# EAGLE design Robot_Psoc_Caras_2_2 (EAGLE 7.5.0)
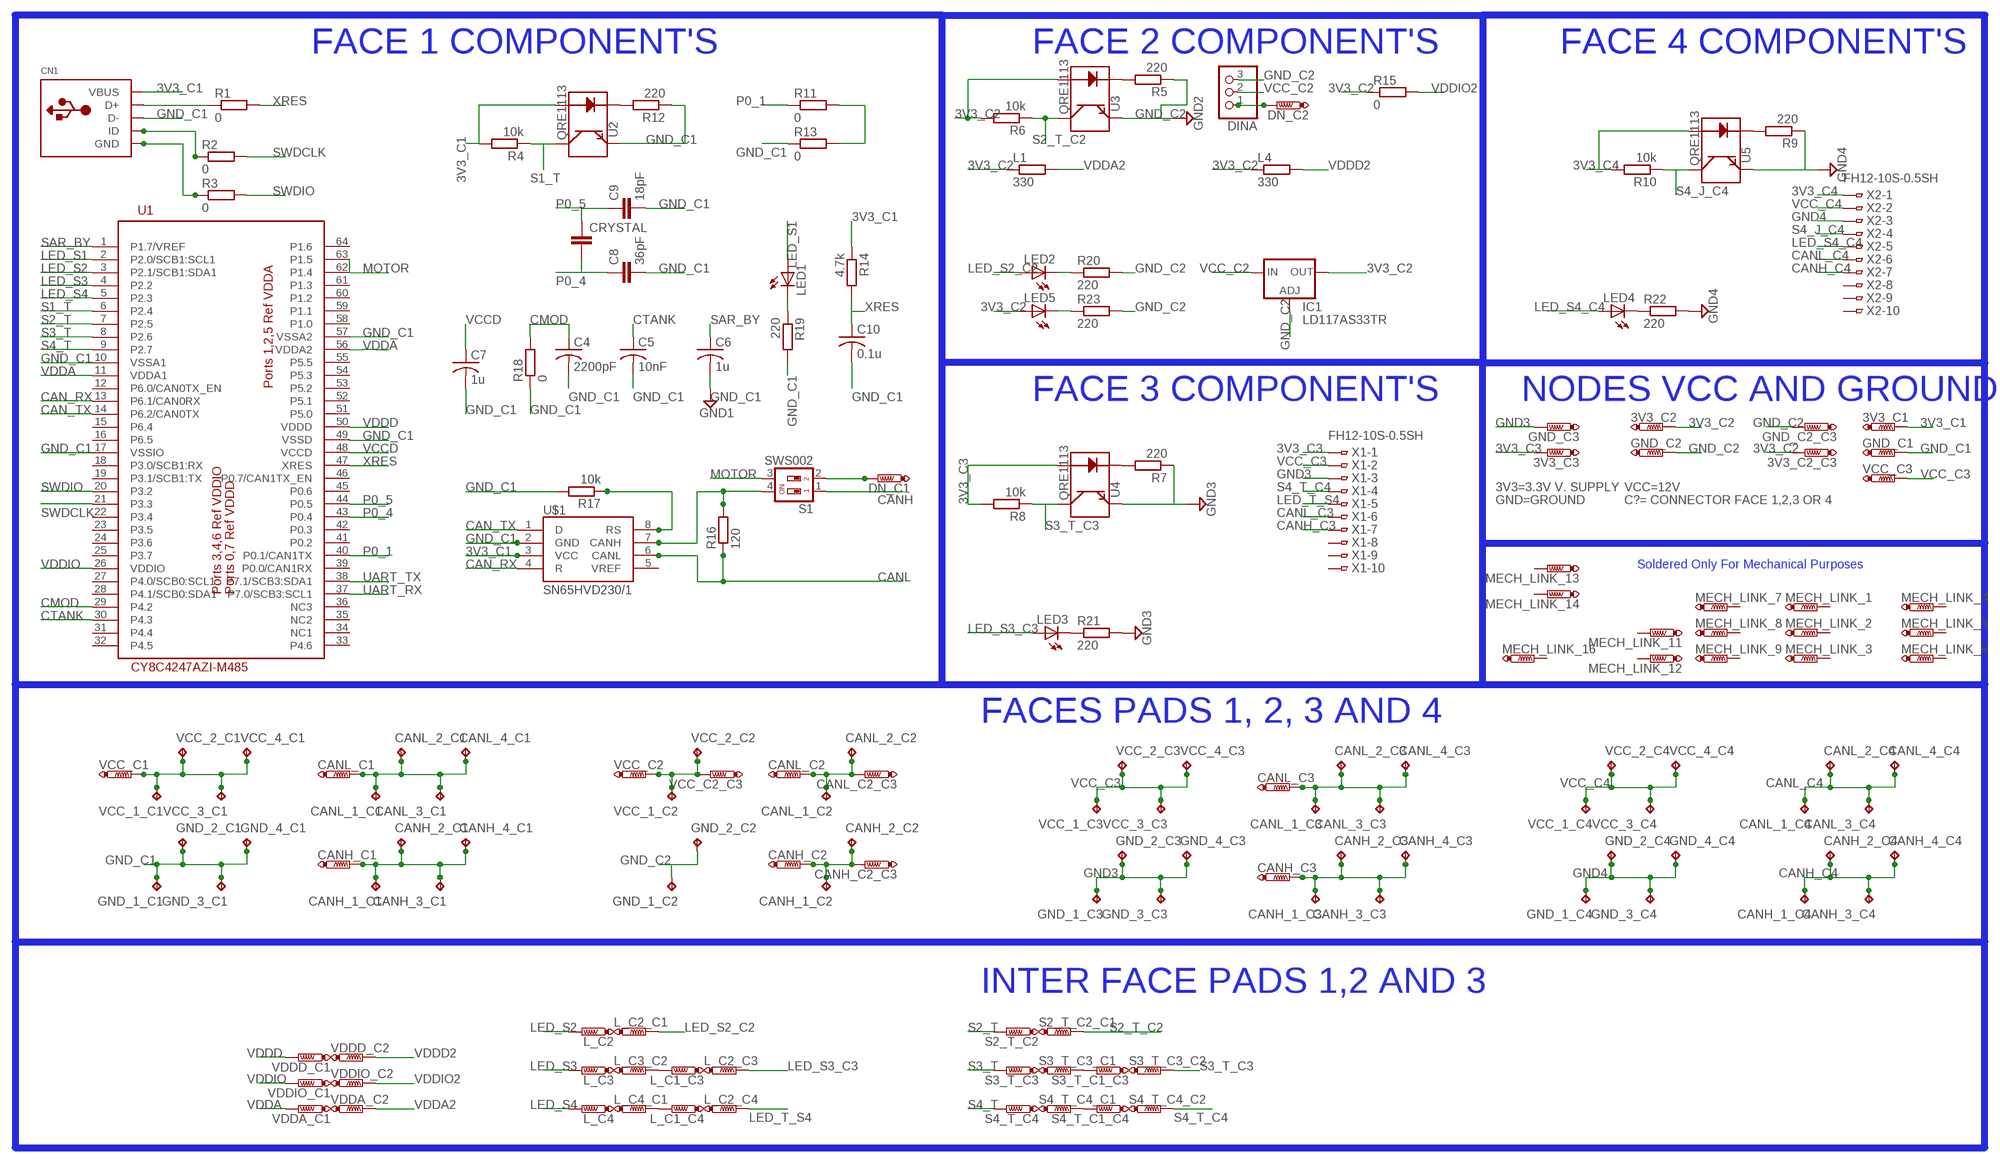
[diagram p0: schematic, sheet 1]

## Parts
3V3_C1  PTR1TP11R  [TP11R]
3V3_C2  PTR1TP11R  [TP11R]
3V3_C2_C3  PTR1TP11R  [TP11R]
3V3_C3  PTR1TP11R  [TP11R]
C4  2200pF  C-USC0805  [C0805]
C5  10nF  C-USC0805  [C0805]
C6  1u  C-USC0805  [C0805]
C7  1u  C-USC0805  [C0805]
C8  36pF  C-EUC0805  [C0805]
C9  18pF  C-EUC0805  [C0805]
C10  0.1u  C-USC0805  [C0805]
CANH_1_C1  TPB2,54  [B2,54]
CANH_1_C2  TPB2,54  [B2,54]
CANH_1_C3  TPB2,54  [B2,54]
CANH_1_C4  TPB2,54  [B2,54]
CANH_2_C1  TPB2,54  [B2,54]
CANH_2_C2  TPB2,54  [B2,54]
CANH_2_C3  TPB2,54  [B2,54]
CANH_2_C4  TPB2,54  [B2,54]
CANH_3_C1  TPB2,54  [B2,54]
CANH_3_C3  TPB2,54  [B2,54]
CANH_3_C4  TPB2,54  [B2,54]
CANH_4_C1  TPB2,54  [B2,54]
CANH_4_C3  TPB2,54  [B2,54]
CANH_4_C4  TPB2,54  [B2,54]
CANH_C1  PTR1TP11R  [TP11R]
CANH_C2  PTR1TP11R  [TP11R]
CANH_C2_C3  PTR1TP11R  [TP11R]
CANH_C3  PTR1TP11R  [TP11R]
CANL_1_C1  TPB2,54  [B2,54]
CANL_1_C2  TPB2,54  [B2,54]
CANL_1_C3  TPB2,54  [B2,54]
CANL_1_C4  TPB2,54  [B2,54]
CANL_2_C1  TPB2,54  [B2,54]
CANL_2_C2  TPB2,54  [B2,54]
CANL_2_C3  TPB2,54  [B2,54]
CANL_2_C4  TPB2,54  [B2,54]
CANL_3_C1  TPB2,54  [B2,54]
CANL_3_C3  TPB2,54  [B2,54]
CANL_3_C4  TPB2,54  [B2,54]
CANL_4_C1  TPB2,54  [B2,54]
CANL_4_C3  TPB2,54  [B2,54]
CANL_4_C4  TPB2,54  [B2,54]
CANL_C1  PTR1TP11R  [TP11R]
CANL_C2  PTR1TP11R  [TP11R]
CANL_C2_C3  PTR1TP11R  [TP11R]
CANL_C3  PTR1TP11R  [TP11R]
CN1  USBMINIB  [USB-MINIB]
CRYSTAL  C-EUC0603  [C0603]
DINA  PINHD-1X3  [1X03]
DN_C1  PTR1TP11R  [TP11R]
DN_C2  PTR1TP11R  [TP11R]
GND_1_C1  TPB2,54  [B2,54]
GND_1_C2  TPB2,54  [B2,54]
GND_1_C3  TPB2,54  [B2,54]
GND_1_C4  TPB2,54  [B2,54]
GND_2_C1  TPB2,54  [B2,54]
GND_2_C2  TPB2,54  [B2,54]
GND_2_C3  TPB2,54  [B2,54]
GND_2_C4  TPB2,54  [B2,54]
GND_3_C1  TPB2,54  [B2,54]
GND_3_C3  TPB2,54  [B2,54]
GND_3_C4  TPB2,54  [B2,54]
GND_4_C1  TPB2,54  [B2,54]
GND_4_C3  TPB2,54  [B2,54]
GND_4_C4  TPB2,54  [B2,54]
GND_C1  PTR1TP11R  [TP11R]
GND_C2  PTR1TP11R  [TP11R]
GND_C2_C3  PTR1TP11R  [TP11R]
GND_C3  PTR1TP11R  [TP11R]
IC1  LD117AS33TR  [SOT223]
L1  330  R-EU_R0805  [R0805]
L4  330  R-EU_R0805  [R0805]
L_C1_C3  PTR1TP11R  [TP11R]
L_C1_C4  PTR1TP11R  [TP11R]
L_C2  PTR1TP11R  [TP11R]
L_C2_C1  PTR1TP11R  [TP11R]
L_C2_C3  PTR1TP11R  [TP11R]
L_C2_C4  PTR1TP11R  [TP11R]
L_C3  PTR1TP11R  [TP11R]
L_C3_C2  PTR1TP11R  [TP11R]
L_C4  PTR1TP11R  [TP11R]
L_C4_C1  PTR1TP11R  [TP11R]
LED1  LEDCHIPLED_0805  [CHIPLED_0805]
LED2  LEDCHIPLED_0805  [CHIPLED_0805]
LED3  LEDCHIPLED_0805  [CHIPLED_0805]
LED4  LEDCHIPLED_0805  [CHIPLED_0805]
LED5  LEDCHIPLED_0805  [CHIPLED_0805]
MECH_LINK_1  PTR1TP11R  [TP11R]
MECH_LINK_2  PTR1TP11R  [TP11R]
MECH_LINK_3  PTR1TP11R  [TP11R]
MECH_LINK_4  PTR1TP11R  [TP11R]
MECH_LINK_5  PTR1TP11R  [TP11R]
MECH_LINK_6  PTR1TP11R  [TP11R]
MECH_LINK_7  PTR1TP11R  [TP11R]
MECH_LINK_8  PTR1TP11R  [TP11R]
MECH_LINK_9  PTR1TP11R  [TP11R]
MECH_LINK_11  PTR1TP11R  [TP11R]
MECH_LINK_12  PTR1TP11R  [TP11R]
MECH_LINK_13  PTR1TP11R  [TP11R]
MECH_LINK_14  PTR1TP11R  [TP11R]
MECH_LINK_16  PTR1TP11R  [TP11R]
R1  0  R-EU_R0805  [R0805]
R2  0  R-EU_R0805  [R0805]
R3  0  R-EU_R0805  [R0805]
R4  10k  R-EU_R0805  [R0805]
R5  220  R-EU_R0805  [R0805]
R6  10k  R-EU_R0805  [R0805]
R7  220  R-EU_R0805  [R0805]
R8  10k  R-EU_R0805  [R0805]
R9  220  R-EU_R0805  [R0805]
R10  10k  R-EU_R0805  [R0805]
R11  0  R-EU_R0805  [R0805]
R12  220  R-EU_R0805  [R0805]
R13  0  R-EU_R0805  [R0805]
R14  4.7k  R-EU_R0805  [R0805]
R15  0  R-EU_R0805  [R0805]
R16  120  R-EU_R0805  [R0805]
R17  10k  R-EU_R0805  [R0805]
R18  0  R-EU_R0805  [R0805]
R19  220  R-EU_R0805  [R0805]
R20  220  R-EU_R0805  [R0805]
R21  220  R-EU_R0805  [R0805]
R22  220  R-EU_R0805  [R0805]
R23  220  R-EU_R0805  [R0805]
S1  SWS002  [SMS-002]
S2_T_C2  PTR1TP11R  [TP11R]
S2_T_C2_C1  PTR1TP11R  [TP11R]
S3_T_C1_C3  PTR1TP11R  [TP11R]
S3_T_C3  PTR1TP11R  [TP11R]
S3_T_C3_C1  PTR1TP11R  [TP11R]
S3_T_C3_C2  PTR1TP11R  [TP11R]
S4_T_C1_C4  PTR1TP11R  [TP11R]
S4_T_C4  PTR1TP11R  [TP11R]
S4_T_C4_C1  PTR1TP11R  [TP11R]
S4_T_C4_C2  PTR1TP11R  [TP11R]
U1  CY8C4247AZI-M485  [TQFP64-10X10]
U2  QRE1113  [QRE1113]
U3  QRE1113  [QRE1113]
U4  QRE1113  [QRE1113]
U5  QRE1113  [QRE1113]
U$1  SN65HVD230/1  [SO8]
VCC_1_C1  TPB2,54  [B2,54]
VCC_1_C2  TPB2,54  [B2,54]
VCC_1_C3  TPB2,54  [B2,54]
VCC_1_C4  TPB2,54  [B2,54]
VCC_2_C1  TPB2,54  [B2,54]
VCC_2_C2  TPB2,54  [B2,54]
VCC_2_C3  TPB2,54  [B2,54]
VCC_2_C4  TPB2,54  [B2,54]
VCC_3_C1  TPB2,54  [B2,54]
VCC_3_C3  TPB2,54  [B2,54]
VCC_3_C4  TPB2,54  [B2,54]
VCC_4_C1  TPB2,54  [B2,54]
VCC_4_C3  TPB2,54  [B2,54]
VCC_4_C4  TPB2,54  [B2,54]
VCC_C1  PTR1TP11R  [TP11R]
VCC_C2  PTR1TP11R  [TP11R]
VCC_C2_C3  PTR1TP11R  [TP11R]
VCC_C3  PTR1TP11R  [TP11R]
VDDA_C1  PTR1TP11R  [TP11R]
VDDA_C2  PTR1TP11R  [TP11R]
VDDD_C1  PTR1TP11R  [TP11R]
VDDD_C2  PTR1TP11R  [TP11R]
VDDIO_C1  PTR1TP11R  [TP11R]
VDDIO_C2  PTR1TP11R  [TP11R]
X1  FH12-10S-0.5SH  [FH12-10S-0.5SH]
X2  FH12-10S-0.5SH  [FH12-10S-0.5SH]

## Nets
3V3_C1: 3V3_C1.TP CN1.VBUS R4.2 R14.1 U2.1(A) U$1.3(VCC)
3V3_C2: 3V3_C2.TP 3V3_C2_C3.TP IC1.4(OUT) L1.1 L4.1 LED5.A R6.2 R15.1 U3.1(A)
3V3_C3: 3V3_C3.TP R8.2 U4.1(A) X1.1
3V3_C4: R10.2 U5.1(A) X2.1
CAN_RX: U1.13(P6.1/CAN0RX) U$1.4(R)
CAN_TX: U1.14(P6.2/CAN0TX) U$1.1(D)
CANH: CANH_1_C1.TP CANH_2_C1.TP CANH_3_C1.TP CANH_4_C1.TP CANH_C1.TP S1.1
CANH_C3: CANH_1_C3.TP CANH_2_C3.TP CANH_3_C3.TP CANH_4_C3.TP CANH_C3.TP X1.7
CANH_C4: CANH_1_C4.TP CANH_2_C4.TP CANH_3_C4.TP CANH_4_C4.TP X2.7
CANL: CANL_1_C1.TP CANL_2_C1.TP CANL_3_C1.TP CANL_4_C1.TP CANL_C1.TP R16.1 U$1.6(CANL)
CANL_C3: CANL_1_C3.TP CANL_2_C3.TP CANL_3_C3.TP CANL_4_C3.TP CANL_C3.TP X1.6
CANL_C4: CANL_1_C4.TP CANL_2_C4.TP CANL_3_C4.TP CANL_4_C4.TP X2.6
CMOD: C4.1 R18.2 U1.29(P4.2)
CTANK: C5.1 U1.30(P4.3)
GND3: GND_1_C3.TP GND_2_C3.TP GND_3_C3.TP GND_4_C3.TP GND_C3.TP R7.1 R21.2 U4.4(E) X1.3
GND4: GND_1_C4.TP GND_2_C4.TP GND_3_C4.TP GND_4_C4.TP R9.1 R22.2 U5.4(E) X2.3
GND_C1: C4.2 C5.2 C6.2 C7.2 C8.2 C9.2 C10.2 CN1.D- GND_1_C1.TP GND_2_C1.TP GND_3_C1.TP GND_4_C1.TP GND_C1.TP R12.1 R13.1 R17.2 R18.1 R19.2 U1.10(VSSA1) U1.17(VSSIO) U1.49(VSSD) U1.57(VSSA2) U2.4(E) U$1.2(GND) ; supply symbol labelled GND1
GND_C2: DINA.3 GND_1_C2.TP GND_2_C2.TP GND_C2.TP GND_C2_C3.TP IC1.1(ADJ) R5.1 R20.2 R23.2 U3.4(E) ; supply symbol labelled GND2
LED_S1: LED1.A U1.2(P2.0/SCB1:SCL1)
LED_S2: L_C2.TP U1.3(P2.1/SCB1:SDA1)
LED_S2_C2: L_C2_C1.TP LED2.A
LED_S3: L_C3.TP U1.4(P2.2)
LED_S3_C3: L_C2_C3.TP LED3.A
LED_S4: L_C4.TP U1.5(P2.3)
LED_S4_C4: LED4.A X2.5
LED_T_S4: L_C2_C4.TP X1.5
MOTOR: S1.3 U1.62(P1.4) U1.63(P1.5)
N$1: CN1.D+ R1.1
N$2: CN1.ID R2.1
N$3: CN1.GND R3.1
N$4: R11.2 R13.2
N$5: R16.2 S1.4 U$1.7(CANH)
N$6: R5.2 U3.2(K)
N$7: CANH_1_C2.TP CANH_2_C2.TP CANH_C2.TP CANH_C2_C3.TP
N$8: R7.2 U4.2(K)
N$9: R17.1 U$1.8(RS)
N$10: R9.2 U5.2(K)
N$13: DN_C1.TP S1.2
N$14: LED1.C R19.1
N$15: LED2.C R20.1
N$16: LED3.C R21.1
N$17: LED4.C R22.1
N$18: LED5.C R23.1
N$19: DINA.1 DN_C2.TP
N$20: L_C1_C4.TP L_C4_C1.TP
N$21: R12.2 U2.2(K)
N$22: L_C1_C3.TP L_C3_C2.TP
N$26: S3_T_C1_C3.TP S3_T_C3_C1.TP
N$27: S4_T_C1_C4.TP S4_T_C4_C1.TP
N$29: VCC_1_C1.TP VCC_2_C1.TP VCC_3_C1.TP VCC_4_C1.TP VCC_C1.TP
N$32: CANL_1_C2.TP CANL_2_C2.TP CANL_C2.TP CANL_C2_C3.TP
P0_1: R11.1 U1.40(P0.1/CAN1TX)
P0_4: C8.1 CRYSTAL.2 U1.43(P0.4)
P0_5: C9.1 CRYSTAL.1 U1.44(P0.5)
S1_T: R4.1 U1.6(P2.4) U2.3(C)
S2_T: S2_T_C2.TP U1.7(P2.5)
S2_T_C2: R6.1 S2_T_C2_C1.TP U3.3(C)
S3_T: S3_T_C3.TP U1.8(P2.6)
S3_T_C3: R8.1 S3_T_C3_C2.TP U4.3(C)
S4_J_C4: R10.1 U5.3(C) X2.4
S4_T: S4_T_C4.TP U1.9(P2.7)
S4_T_C4: S4_T_C4_C2.TP X1.4
SAR_BY: C6.1 U1.1(P1.7/VREF)
SWDCLK: R2.2 U1.21(P3.3)
SWDIO: R3.2 U1.20(P3.2)
UART_RX: U1.37(P7.0/SCB3:SCL1)
UART_TX: U1.38(P7.1/SCB3:SDA1)
VCC_C2: DINA.2 IC1.3(IN) VCC_1_C2.TP VCC_2_C2.TP VCC_C2.TP VCC_C2_C3.TP
VCC_C3: VCC_1_C3.TP VCC_2_C3.TP VCC_3_C3.TP VCC_4_C3.TP VCC_C3.TP X1.2
VCC_C4: VCC_1_C4.TP VCC_2_C4.TP VCC_3_C4.TP VCC_4_C4.TP X2.2
VCCD: C7.1 U1.48(VCCD)
VDDA: U1.11(VDDA1) U1.56(VDDA2) VDDA_C1.TP
VDDA2: L1.2 VDDA_C2.TP
VDDD: U1.50(VDDD) VDDD_C1.TP
VDDD2: L4.2 VDDD_C2.TP
VDDIO: U1.26(VDDIO) VDDIO_C1.TP
VDDIO2: R15.2 VDDIO_C2.TP
XRES: C10.1 R1.2 R14.2 U1.47(XRES)
Unconnected: MECH_LINK_1.TP MECH_LINK_2.TP MECH_LINK_3.TP MECH_LINK_4.TP MECH_LINK_5.TP MECH_LINK_6.TP MECH_LINK_7.TP MECH_LINK_8.TP MECH_LINK_9.TP MECH_LINK_11.TP MECH_LINK_12.TP MECH_LINK_13.TP MECH_LINK_14.TP MECH_LINK_16.TP U1.12(P6.0/CAN0TX_EN) U1.15(P6.4) U1.16(P6.5) U1.18(P3.0/SCB1:RX) U1.19(P3.1/SCB1:TX) U1.22(P3.4) U1.23(P3.5) U1.24(P3.6) U1.25(P3.7) U1.27(P4.0/SCB0:SCL1) U1.28(P4.1/SCB0:SDA1) U1.31(P4.4) U1.32(P4.5) U1.33(P4.6) U1.34(NC1) U1.35(NC2) U1.36(NC3) U1.39(P0.0/CAN1RX) U1.41(P0.2) U1.42(P0.3) U1.45(P0.6) U1.46(P0.7/CAN1TX_EN) U1.51(P5.0) U1.52(P5.1) U1.53(P5.2) U1.54(P5.3) U1.55(P5.5) U1.58(P1.0) U1.59(P1.1) U1.60(P1.2) U1.61(P1.3) U1.64(P1.6) U$1.5(VREF) X1.8 X1.9 X1.10 X2.8 X2.9 X2.10

## Notes on the sheet
- FACE 1 COMPONENT'S | FACE 2 COMPONENT'S | FACE 4 COMPONENT'S
- FACE 3 COMPONENT'S | NODES VCC AND GROUND
- 3V3=3.3V V. SUPPLY | VCC=12V
- GND=GROUND | C?= CONNECTOR FACE 1,2,3 OR 4
- Soldered Only For Mechanical Purposes
- FACES PADS 1, 2, 3 AND 4
- INTER FACE PADS 1,2 AND 3

## Library data of the parts
3V3_C1 3V3_C2 3V3_C2_C3 3V3_C3 CANH_C1 CANH_C2 CANH_C2_C3 CANH_C3 CANL_C1 CANL_C2 CANL_C2_C3 CANL_C3 DN_C1 DN_C2 GND_C1 GND_C2 GND_C2_C3 GND_C3 L_C1_C3 L_C1_C4 L_C2 L_C2_C1 L_C2_C3 L_C2_C4 L_C3 L_C3_C2 L_C4 L_C4_C1 MECH_LINK_1-MECH_LINK_9 MECH_LINK_11-MECH_LINK_14 MECH_LINK_16 S2_T_C2 S2_T_C2_C1 S3_T_C1_C3 S3_T_C3 S3_T_C3_C1 S3_T_C3_C2 S4_T_C1_C4 S4_T_C4 S4_T_C4_C1 S4_T_C4_C2 VCC_C1 VCC_C2 VCC_C2_C3 VCC_C3 VDDA_C1 VDDA_C2 VDDD_C1 VDDD_C2 VDDIO_C1 VDDIO_C2 = testpad:PTR1: TEST PIN
C4-C7 C10 = rcl:C-US: CAPACITOR, American symbol
C8 C9 CRYSTAL = rcl:C-EU: CAPACITOR, European symbol
CANH_1_C1-CANH_1_C4 CANH_2_C1-CANH_2_C4 CANH_3_C1 CANH_3_C3 CANH_3_C4 CANH_4_C1 CANH_4_C3 CANH_4_C4 CANL_1_C1-CANL_1_C4 CANL_2_C1-CANL_2_C4 CANL_3_C1 CANL_3_C3 CANL_3_C4 CANL_4_C1 CANL_4_C3 CANL_4_C4 GND_1_C1-GND_1_C4 GND_2_C1-GND_2_C4 GND_3_C1 GND_3_C3 GND_3_C4 GND_4_C1 GND_4_C3 GND_4_C4 VCC_1_C1-VCC_1_C4 VCC_2_C1-VCC_2_C4 VCC_3_C1 VCC_3_C3 VCC_3_C4 VCC_4_C1 VCC_4_C3 VCC_4_C4 = testpad:TP: Test pad
CN1 = adafruit:USB: USB Connectors USBMINIB - Surface Mount Female Mini-B USB Connector 4UConnector: 06564 By microbuilder.eu Thru-hole RA Female Mini-B USB Connector 4UConnector: 18732 By ladyada.net
DINA = pinhead:PINHD-1X3: PIN HEADER
IC1 = v-reg:LD117A?*: Low drop fixed and adjustable positive voltage regulators 1 A Source: http://www.st.com/stonline/products/literature/ds/7194/ld1117axx.pdf
L1 L4 R1-R23 = rcl:R-EU_: RESISTOR, European symbol
LED1-LED5 = adafruit:LED: LED OSRAM: - CHIPLED LG R971, LG N971, LY N971, LG Q971, LY Q971, LO R971, LY R971 LH N974, LH R974 LS Q976, LO Q976, LY Q976 LO Q996 - Hyper CHIPLED LW Q18S LB Q993, LB Q99A, LB R99A - SideLED LS A670, LO A670, LY A670, LG A670, LP A670 LB A673, LV A673, LT A673, LW A673 LH A674 LY A675 LS A676, LA A676, LO A676, LY A676, LW A676 LS A679, LY A679, LG A679 - Hyper Micro SIDELED® LS Y876, LA Y876, LO Y876, LY Y876 LT Y87S - SmartLED LW L88C, LW L88S LB L89C, LB L89S, LG L890 LS L89K, LO L89K, LY L89K LS L896, LA L896, LO L896, LY L896 - TOPLED LS T670, LO T670, LY T670, LG T670, LP T670 LSG T670, LSP T670, LSY T670, LOP T670, LYG T670 LG T671, LOG T671, LSG T671 LB T673, LV T673, LT T673, LW T673 LH T674 LS T676, LA T676, LO T676, LY T676, LB T676, LH T676, LSB T676, LW T676 LB T67C, LV T67C, LT T67C, LS T67K, LO T67K, LY T67K, LW E67C LS E67B, LA E67B, LO E67B, LY E67B, LB E67C, LV E67C, LT E67C LW T67C LS T679, LY T679, LG T679 LS T770, LO T770, LY T770, LG T770, LP T770 LB T773, LV T773, LT T773, LW T773 LH T774 LS E675, LA E675, LY E675, LS T675 LS T776, LA T776, LO T776, LY T776, LB T776 LHGB T686 LT T68C, LB T68C - Hyper Mini TOPLED® LB M676 - Mini TOPLED Santana® LG M470 LS M47K, LO M47K, LY M47K Source: http://www.osram.convergy.de/
S1 = smd-special:SWS002: SMD Dip Switch 2 pol.
U1 = CypressPSoC:CY8C4247AZI-M485
U2-U5 = SparkFun-Sensors:QRE1113: Reflective object sensor; PROD_ID: IC-09357
U$1 = texas_instruments:SN65HVD230/1
X1 X2 = con-hirose2:FH12-10S-0.5S: 0.5mm Pitch Connectors For FPC/FFC Source: Data sheet <http://www.hirose.co.jp/cataloge_hp/e58605370.pdf>; MPN: FH12-10S-0.5SH(55); OC_FARNELL: 1324540; OC_NEWARK: 34M6152

## Board
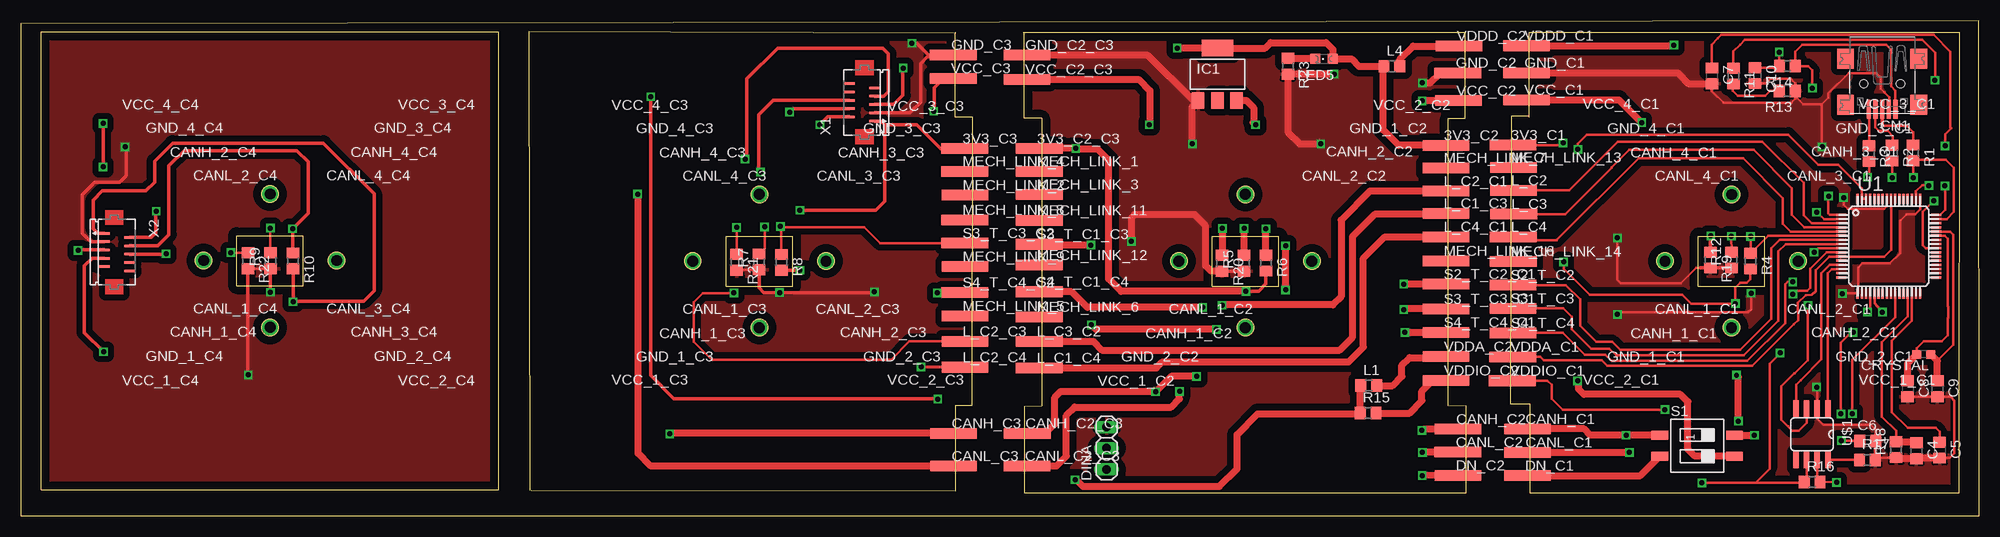
[diagram p1: board, top side]
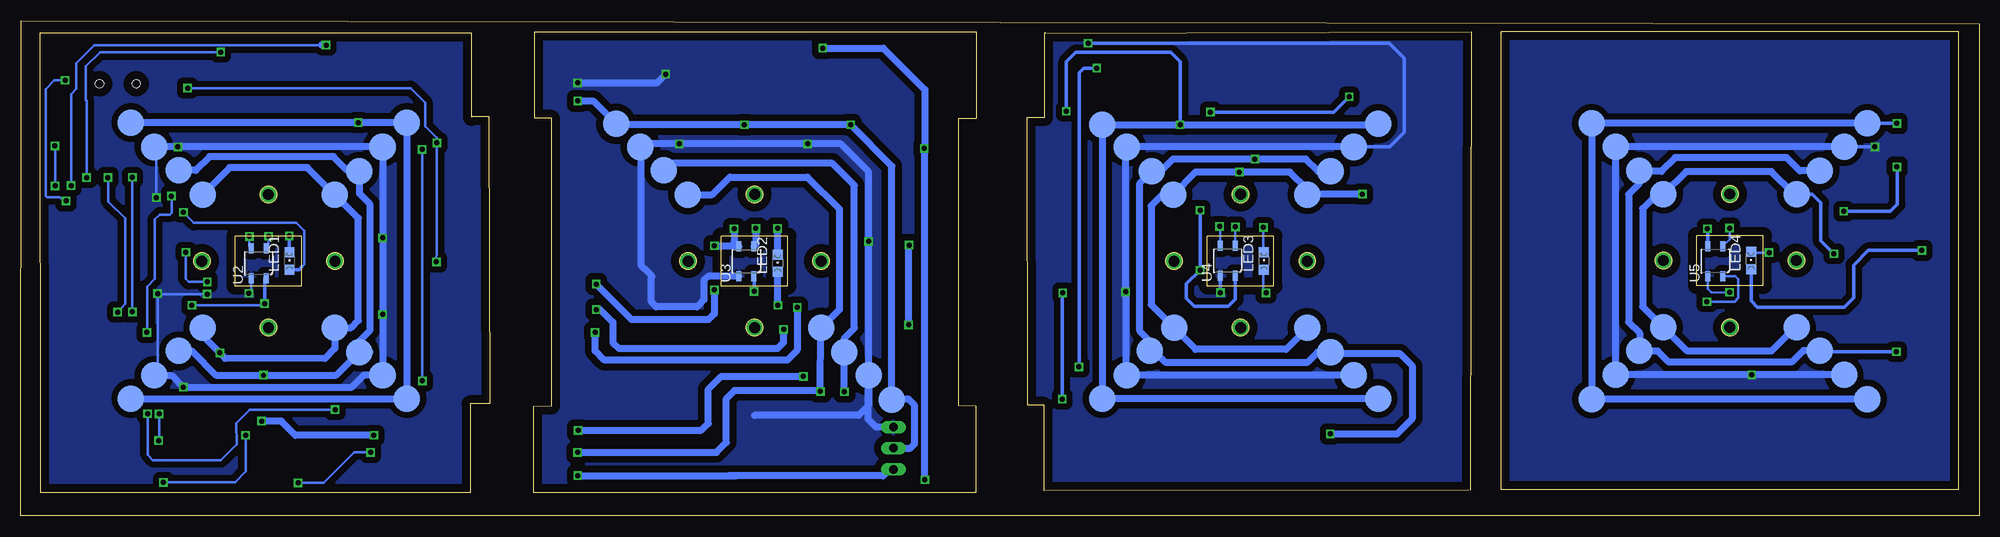
[diagram p2: board, bottom side, seen from below]

Size 235.34 x 59.49 mm. Coordinates in mm from the lower left corner, seen from the top.
Outline: 120.48,58.13 173.65,58.13
Outline: 112.32,58.01 112.32,47.88 114.38,47.88 114.35,13.28 112.37,13.28 112.37,3 61.32,3.05
Outline: 112.29,58.09 112.32,58.01
Outline: 112.32,58.01 61.06,58.17 61.19,3.05
Outline: 173.58,58.04 173.58,47.75 171.55,47.75 171.55,13.21 173.69,13.18 173.69,2.77 120.6,2.77 120.6,13.18 122.66,13.21 122.66,47.75 120.55,47.8 120.55,58.09
Outline: 181.2,48.01 179.1,48.03 178.97,13.46 181.33,13.46 181.33,2.79 232.97,2.79 233.02,58.04 181.2,58.04 181.2,47.88
Outline: 0,0 235.34,0 235.29,59.49 0,59.11 0,0
Outline: 151.17,27.61 151.17,33.61 143.17,33.61 143.17,27.61 151.17,27.61
Outline: 2.45,3.16 2.45,58.16 57.45,58.16 57.45,3.16 2.45,3.16
Outline: 33.95,27.66 33.95,33.66 25.95,33.66 25.95,27.66 33.95,27.66
Outline: 92.75,27.61 92.75,33.61 84.75,33.61 84.75,27.61 92.75,27.61
Outline: 209.59,27.61 209.59,33.61 201.59,33.61 201.59,27.61 209.59,27.61
Outline: circle at 139.17,30.61 radius 1
Outline: circle at 147.17,38.61 radius 1
Outline: circle at 155.17,30.61 radius 1
Outline: circle at 147.17,22.61 radius 1
Outline: circle at 21.95,30.66 radius 1
Outline: circle at 29.95,38.66 radius 1
Outline: circle at 37.95,30.66 radius 1
Outline: circle at 29.95,22.66 radius 1
Outline: circle at 80.75,30.61 radius 1
Outline: circle at 88.75,38.61 radius 1
Outline: circle at 96.75,30.61 radius 1
Outline: circle at 88.75,22.61 radius 1
Outline: circle at 197.59,30.61 radius 1
Outline: circle at 205.59,38.61 radius 1
Outline: circle at 213.59,30.61 radius 1
Outline: circle at 205.59,22.61 radius 1
Copper layers (1*16): Top 0.035mm / dielectric 1.5mm / Bottom 0.035mm
Design rules "default": minimum track width 10mil, minimum drill 24mil, track to track 8mil, track to pad 8mil, pad to pad 8mil, via to via 8mil, smd to smd 8mil, copper to edge 40mil, drill to drill 8mil, minimum pad ring 10mil, minimum via ring 8mil, stop-mask expansion 4mil, vias tented up to drill 0mil, thermal gap 10mil

### Footprints (pad centres in the part's own frame; a part is rotated, then mirrored left to right if it is on the bottom)
TP11R = smd 0.635 x 1.27: P$1 0.381,0; P$2 1.016,0; P$3 -0.254,0; P$4 -0.889,0; P$5 -1.524,0; P$6 1.613,0; P$7 2.21,0; P$8 -2.146,0; P$9 -2.769,0 | smd 1.1 x 1.1: TP 0,0
C0805 = smd 1.3 x 1.5: 1 -0.95,0; 2 0.95,0
B2,54 = smd 3.175 x 3.175 bottom: P$1 0,0 | smd 2.54 x 2.54 bottom: TP 0,0
USB-MINIB = smd 0.5 x 2.308: D+ 0,4.064; D- -0.8,4.064; GND 1.6,4.064; ID 0.8,4.064; VBUS -1.6,4.064 | smd 2 x 2.4: GND1 -4.4,-2; GND2 -4.4,3.5; GND3 4.4,3.5; GND4 4.4,-2 | hole 1: -2.2,1; 2.2,1
C0603 = smd 1.1 x 1: 1 -0.85,0; 2 0.85,0
1X03 = drill 1.016 long: 1 -2.54,0; 2 0,0; 3 2.54,0
SOT223 = smd 1.5 x 2: 1 -2.3,-3.15; 2 0,-3.15; 3 2.3,-3.15 | smd 3.8 x 2: 4 0,3.15
R0805 = smd 1.3 x 1.5: 1 -0.95,0; 2 0.95,0
CHIPLED_0805 = smd 1.2 x 1.2: A 0,-1.05; C 0,1.05
SMS-002 = smd 1.092 x 2.007: 1 -1.27,-4.496; 2 1.27,-4.496; 3 1.27,4.496; 4 -1.27,4.496
TQFP64-10X10 = smd 1.2 x 0.3: 1 -5.7,3.75; 2 -5.7,3.25; 3 -5.7,2.75; 4 -5.7,2.25; 5 -5.7,1.75; 6 -5.7,1.25; 7 -5.7,0.75; 8 -5.7,0.25; 9 -5.7,-0.25; 10 -5.7,-0.75; 11 -5.7,-1.25; 12 -5.7,-1.75; 13 -5.7,-2.25; 14 -5.7,-2.75; 15 -5.7,-3.25; 16 -5.7,-3.75; 33 5.7,-3.75; 34 5.7,-3.25; 35 5.7,-2.75; 36 5.7,-2.25; 37 5.7,-1.75; 38 5.7,-1.25; 39 5.7,-0.75; 40 5.7,-0.25; 41 5.7,0.25; 42 5.7,0.75; 43 5.7,1.25; 44 5.7,1.75; 45 5.7,2.25; 46 5.7,2.75; 47 5.7,3.25; 48 5.7,3.75 | smd 0.3 x 1.2: 17 -3.75,-5.7; 18 -3.25,-5.7; 19 -2.75,-5.7; 20 -2.25,-5.7; 21 -1.75,-5.7; 22 -1.25,-5.7; 23 -0.75,-5.7; 24 -0.25,-5.7; 25 0.25,-5.7; 26 0.75,-5.7; 27 1.25,-5.7; 28 1.75,-5.7; 29 2.25,-5.7; 30 2.75,-5.7; 31 3.25,-5.7; 32 3.75,-5.7; 49 3.75,5.7; 50 3.25,5.7; 51 2.75,5.7; 52 2.25,5.7; 53 1.75,5.7; 54 1.25,5.7; 55 0.75,5.7; 56 0.25,5.7; 57 -0.25,5.7; 58 -0.75,5.7; 59 -1.25,5.7; 60 -1.75,5.7; 61 -2.25,5.7; 62 -2.75,5.7; 63 -3.25,5.7; 64 -3.75,5.7
QRE1113 = smd 1.2 x 0.6: 1 -1.8,-0.9; 2 1.8,-0.9; 3 1.8,0.9; 4 -1.8,0.9
SO8 = smd 0.66 x 2.032: 1 -1.905,-3.073; 2 -0.635,-3.073; 3 0.635,-3.073; 4 1.905,-3.073; 5 1.905,3.073; 6 0.635,3.073; 7 -0.635,3.073; 8 -1.905,3.073
FH12-10S-0.5SH = smd 0.3 x 1.3: 1 -2.25,-1.195; 2 -1.75,1.853; 3 -1.25,-1.195; 4 -0.75,1.853; 5 -0.25,-1.195; 6 0.25,1.853; 7 0.75,-1.195; 8 1.25,1.853; 9 1.75,-1.195; 10 2.25,1.853

### Placement (x,y rotation side)
3V3_C1  179.6,44.55 0 top
3V3_C2  171.55,44.53 0 top
3V3_C2_C3  122.66,44.12 0 top
3V3_C3  113.72,44.12 0 top
C4  227.79,7.82 270 top
C5  230.58,7.9 270 top
C6  221.95,9.02 0 top
C7  203.23,52.86 270 top
C8  226.75,15.27 270 top
C9  230.3,15.27 270 top
C10  208.41,52.91 270 top
CANH_1_C1  194.67,19.69 0 top
CANH_1_C2  136.37,19.69 0 top
CANH_1_C3  77.95,19.69 0 top
CANH_1_C4  19.15,19.86 0 top
CANH_2_C1  216.38,19.81 0 top
CANH_2_C2  158.09,41.53 0 top
CANH_2_C3  99.67,19.81 0 top
CANH_2_C4  19.15,41.45 0 top
CANH_3_C1  216.38,41.53 0 top
CANH_3_C3  99.42,41.4 0 top
CANH_3_C4  40.87,19.86 0 top
CANH_4_C1  194.67,41.4 0 top
CANH_4_C3  77.95,41.4 0 top
CANH_4_C4  40.87,41.45 0 top
CANH_C1  181.33,10.44 0 top
CANH_C2  173,10.41 0 top
CANH_C2_C3  121.23,9.91 0 top
CANH_C3  112.37,9.91 0 top
CANL_1_C1  197.59,22.61 0 top
CANL_1_C2  139.17,22.61 0 top
CANL_1_C3  80.75,22.61 0 top
CANL_1_C4  21.95,22.66 0 top
CANL_2_C1  213.46,22.61 0 top
CANL_2_C2  155.17,38.61 0 top
CANL_2_C3  96.75,22.61 0 top
CANL_2_C4  21.95,38.66 0 top
CANL_3_C1  213.46,38.61 0 top
CANL_3_C3  96.88,38.61 0 top
CANL_3_C4  37.95,22.66 0 top
CANL_4_C1  197.59,38.61 0 top
CANL_4_C3  80.75,38.61 0 top
CANL_4_C4  37.95,38.66 0 top
CANL_C1  181.33,7.62 0 top
CANL_C2  172.95,7.65 0 top
CANL_C2_C3  121.18,5.99 0 top
CANL_C3  112.37,5.97 0 top
CN1  223.67,52.91 180 top
CRYSTAL  228.68,19.41 180 top
DINA  130.48,8.13 90 top
DN_C1  181.33,4.83 0 top
DN_C2  173,4.85 0 top
GND_1_C1  191.87,16.89 0 top
GND_1_C2  160.88,44.32 0 top
GND_1_C3  75.16,16.89 0 top
GND_1_C4  16.23,16.94 0 top
GND_2_C1  219.3,16.89 0 top
GND_2_C2  133.45,16.89 0 top
GND_2_C3  102.46,16.89 0 top
GND_2_C4  43.66,16.94 0 top
GND_3_C1  219.3,44.32 0 top
GND_3_C3  102.46,44.32 0 top
GND_3_C4  43.66,44.37 0 top
GND_4_C1  191.87,44.32 0 top
GND_4_C3  75.16,44.32 0 top
GND_4_C4  16.23,44.37 0 top
GND_C1  181.2,53.24 0 top
GND_C2  172.95,53.24 0 top
GND_C2_C3  121.21,55.37 0 top
GND_C3  112.32,55.4 0 top
IC1  143.79,53.06 0 top
L1  161.98,15.65 0 top
L4  164.77,54.03 0 top
L_C1_C3  171.55,36.35 0 top
L_C1_C4  122.66,17.78 0 top
L_C2  179.65,39.12 0 top
L_C2_C1  171.55,39.01 0 top
L_C2_C3  113.74,20.95 0 top
L_C2_C4  113.74,17.86 0 top
L_C3  179.68,36.27 0 top
L_C3_C2  122.66,20.95 0 top
L_C4  179.63,33.53 0 top
L_C4_C1  171.55,33.53 0 top
LED1  203.05,30.61 0 bottom
LED2  144.37,30.35 0 bottom
LED3  85.95,30.61 0 bottom
LED4  27.41,30.66 0 bottom
LED5  156.59,54.91 90 top
MECH_LINK_1  122.66,41.4 0 top
MECH_LINK_2  113.74,38.53 0 top
MECH_LINK_3  122.66,38.61 0 top
MECH_LINK_4  113.72,41.4 0 top
MECH_LINK_5  113.74,24 0 top
MECH_LINK_6  122.66,23.9 0 top
MECH_LINK_7  171.55,41.81 0 top
MECH_LINK_8  113.72,35.56 0 top
MECH_LINK_9  113.74,29.95 0 top
MECH_LINK_11  122.66,35.51 0 top
MECH_LINK_12  122.66,30.12 0 top
MECH_LINK_13  179.65,41.86 0 top
MECH_LINK_14  179.63,30.56 0 top
MECH_LINK_16  171.55,30.63 0 top
R1  227.41,43.61 270 top
R2  224.87,43.59 270 top
R3  222.1,43.54 270 top
R4  207.87,30.61 270 top
R5  146.99,30.35 90 top
R6  149.63,30.38 270 top
R7  88.7,30.51 90 top
R8  91.39,30.45 270 top
R9  30,30.66 90 top
R10  32.72,30.63 270 top
R11  205.79,52.83 270 top
R12  205.59,30.73 90 top
R13  212.27,51.08 180 top
R14  212.29,54.05 180 top
R15  161.9,12.34 0 top
R16  215.26,4.06 0 top
R17  221.89,6.73 0 top
R18  225.35,7.95 90 top
R19  203.05,30.73 270 top
R20  144.37,30.35 270 top
R21  86.03,30.48 270 top
R22  27.28,30.66 270 top
R23  152.27,54.03 270 top
S1  201.45,8.43 270 top
S2_T_C2  179.58,27.74 0 top
S2_T_C2_C1  171.55,27.84 0 top
S3_T_C1_C3  122.66,32.64 0 top
S3_T_C3  179.58,24.92 0 top
S3_T_C3_C1  171.55,24.87 0 top
S3_T_C3_C2  113.72,32.77 0 top
S4_T_C1_C4  122.66,26.92 0 top
S4_T_C4  179.6,21.97 0 top
S4_T_C4_C1  171.55,22.05 0 top
S4_T_C4_C2  113.72,26.85 0 top
U1  224.49,32.41 0 top
U2  206.73,30.35 90 bottom
U3  148.13,30.58 90 bottom
U4  90.3,30.66 90 bottom
U5  31.7,30.61 90 bottom
U$1  215.24,9.8 180 top
VCC_1_C1  222.1,14.1 0 top
VCC_1_C2  130.66,13.97 0 top
VCC_1_C3  72.24,14.1 0 top
VCC_1_C4  13.44,14.02 0 top
VCC_2_C1  188.95,14.1 0 top
VCC_2_C2  163.8,47.12 0 top
VCC_2_C3  105.38,14.1 0 top
VCC_2_C4  46.58,14.02 0 top
VCC_3_C1  222.1,47.24 0 top
VCC_3_C3  105.38,46.99 0 top
VCC_3_C4  46.58,47.17 0 top
VCC_4_C1  188.95,47.24 0 top
VCC_4_C3  72.24,47.12 0 top
VCC_4_C4  13.44,47.17 0 top
VCC_C1  181.2,49.99 0 top
VCC_C2  173.05,49.89 0 top
VCC_C2_C3  121.21,52.45 0 top
VCC_C3  112.32,52.58 0 top
VDDA_C1  179.55,19.1 0 top
VDDA_C2  171.55,19.13 0 top
VDDD_C1  181.23,56.49 0 top
VDDD_C2  173.1,56.46 0 top
VDDIO_C1  179.5,16.23 0 top
VDDIO_C2  171.55,16.26 0 top
X1  101.4,49.68 90 top
X2  11.23,31.7 270 top

### Tracks (layer width: path | path; a pad name or v marks a point on that pad's centre or on a via)
3V3_C1  (via drill 0.6)
  Top 0.305: 3V3_C1.TP 185.45,44.55 v185.34,44.81 | 207.9,29.63 R4.2 207.85,29.63 207.85,28.42 207.42,27.99 206.63,27.99 206.04,27.41 v206.04,25.5 200.74,25.5 199.67,26.57 188.54,26.57 185.39,29.72 185.42,30.48 v185.39,30.5 | U$1.3 214.6,11.18 213.66,10.24 212.88,10.24 | 212.88,10.24 212.85,10.24 211.56,11.53 211.56,15.55 213.13,17.12 213.16,17.12 214.76,18.72 214.76,25.27 v214.78,25.3 | 212.88,10.24 212.37,10.74 212.42,10.74 | CN1.VBUS 225.27,51.11 224.74,51.64 224.74,56.03 224.15,56.62 214.05,56.62 213.21,55.78 213.21,54.09 R14.1 214.78,54.05 215.29,53.54 v215.29,51.41
  Top 0.406: 207.75,29.78 R4.2
  Bottom 0.305: v185.39,30.5 185.34,31.88 v185.34,44.81 185.37,44.14 185.37,45.44 186.74,46.81 186.74,49.66 188.49,51.41 v215.29,51.41 | 205.83,25.72 v206.04,25.5 206.25,25.3 v214.78,25.3
  Bottom 0.406: U2.1 206.04,28.55 v206.04,25.5
3V3_C2  (via drill 0.6)
  Top 0.406: 149.61,29.4 R6.2 149.63,27.86 148.74,26.97 v147.22,26.97
  Top 0.813: v126.7,4.34 126.75,4.39 126.77,4.39 127.63,3.53 144.04,3.53 146.15,5.64 146.15,9.75 148.64,12.24 160.85,12.24 R15.1 160.95,15.57 L1.1 161,15.67 | 3V3_C2_C3.TP 122.68,44.14 v126.77,44.14 126.85,44.07 129.41,44.07 130.73,42.75 130.73,28.47 132.23,26.97 v147.22,26.97 | 3V3_C2.TP 165.56,44.53 163.7,46.38 163.7,53.91 L4.1 160.81,54.03 159.92,54.92 LED5.A 157.66,54.93 157.66,56.06 156.84,56.87 150.19,56.87 149.53,56.21 IC1.4 v138.96,56.21
  Bottom 0.406: U3.1 147.22,28.78 v147.22,26.97
  Bottom 0.813: v126.7,4.34 126.7,44.07 v126.77,44.14 126.7,44.22 126.7,51.23 131.67,56.21 v138.96,56.21
3V3_C3  (via drill 0.6)
  Top 0.406: X1.1 103.37,47.43 103.81,46.99 | 103.81,46.99 103.81,37.8 102.74,36.73 v93.62,36.73 | v93.62,29.52 91.4,29.52 R8.2 | 103.81,46.99 107.67,46.99 110.57,44.09 114.63,44.09 3V3_C3.TP
  Bottom 0.406: v93.62,36.73 v93.62,29.52 95.28,27.86 95.28,26.16 94.31,25.2 90.22,25.2 89.4,26.02 U4.1
3V3_C4  (via drill 0.6)
  Top 0.305: 32.76,29.64 R10.2
  Top 0.406: R10.2 v32.72,25.73 32.79,25.81 41.2,25.81 42.44,27.05 42.44,38.68 36.35,44.78 18.24,44.78 16.08,42.62 16.08,40.08 15.04,39.04 9.8,39.04 8.71,37.95 8.71,34.49 9.26,33.95 X2.1
  Top 0.813: 32.69,29.71 R10.2
  Bottom 0.305: U5.1 29.29,28.81 28.93,28.45 28.93,26.19 29.39,25.73 v32.72,25.73
CAN_RX
  Top 0.305: U1.13 217.38,30.16 216.38,29.16 216.38,18.8 213.89,16.31 213.89,16.28 213.33,15.72 U$1.4
CAN_TX
  Top 0.305: U1.14 217.65,29.66 217.14,29.16 U$1.1
CANH  (via drill 0.6)
  Top 0.813: CANH_C1.TP 187.86,10.44 188.59,9.7 S1.1 192.94,9.7 v192.91,9.68 | v206.4,11.38 206.4,16.69 v206.17,16.92
  Bottom 0.813: 216.89,19.81 CANH_2_C1.TP 214.78,19.81 211.89,16.92 v206.17,16.92 197.43,16.92 CANH_1_C1.TP | CANH_1_C1.TP 193.4,19.69 | v192.91,9.68 202.34,9.68 204.04,11.38 v206.4,11.38 | CANH_1_C1.TP 194.67,21.01 193.34,22.33 193.34,37.44 194.61,38.71 194.61,41.35 CANH_4_C1.TP 194.79,41.53 196.14,41.53 197.76,43.16 212.65,43.16 214.3,41.5 216.36,41.5 CANH_3_C1.TP
CANH_C3  (via drill 0.6)
  Top 0.406: X1.7 103.72,50.43 104.27,50.98 104.27,55.55 103.61,56.21 90.96,56.21 87.25,52.5 87.25,43.08 v87.05,42.88
  Top 0.813: CANH_C3.TP 78.03,9.91 v77.98,9.86
  Bottom 0.813: CANH_4_C3.TP 79.45,41.4 80.92,42.88 v87.05,42.88 96.9,42.88 98.4,41.38 99.39,41.38 CANH_3_C3.TP 100.86,39.95 100.86,22.2 99.67,21.01 99.67,20.34 | CANH_2_C3.TP 99.67,20.34 | 99.67,20.34 97.74,18.42 80.77,18.42 79.5,19.69 CANH_1_C3.TP 77.72,19.46 69.57,19.46 68.07,17.96 68.07,11.73 69.95,9.86 v77.98,9.86
CANH_C4  (via drill 0.6)
  Top 0.406: X2.7 8.57,30.95 7.65,30.02 7.65,22.02 v9.96,19.71
  Bottom 0.406: v9.96,19.71 19,19.71 CANH_1_C4.TP
  Bottom 0.813: CANH_2_C4.TP 21.54,41.45 23.14,43.05 36.55,43.05 38.2,41.4 40.82,41.4 CANH_4_C4.TP 40.87,39.88 42.11,38.63 42.11,23.27 40.82,21.97 40.82,19.91 CANH_3_C4.TP 40.79,19.79 38.61,19.79 37.29,18.47 22.53,18.47 21.13,19.86 CANH_1_C4.TP
CANL  (via drill 0.6)
  Top 0.305: U$1.6 214.6,4.35 R16.1 214.21,3.96 208.46,3.96 | v202.01,3.96 208.46,3.96 | v211.42,19.57 211.42,19.55 210.16,18.29 210.16,5.66 208.46,3.96
  Top 0.813: CANL_C1.TP v193.29,7.62
  Bottom 0.305: v193.29,7.62 195.25,7.62 198.91,3.96 v202.01,3.96
  Bottom 0.813: CANL_2_C1.TP 213.17,21.35 v211.42,19.57 210.79,18.92 198.81,18.9 197.59,20.12 CANL_1_C1.TP 195.66,22.61 194.77,23.5 194.77,35.79 CANL_4_C1.TP 197.61,38.58 197.66,38.58 200.91,41.83 210.24,41.83 CANL_3_C1.TP
CANL_C3  (via drill 0.6)
  Top 0.406: X1.6 90.42,49.93 88.67,48.18 88.67,41.53 v88.9,41.3
  Top 0.813: CANL_C3.TP 75.72,5.97 74.19,7.49 74.19,38.58 v74.12,38.66
  Bottom 0.813: CANL_1_C3.TP 80.37,22.22 81.03,22.22 83.29,19.99 94.16,19.99 CANL_2_C3.TP 99.52,25.38 99.52,37.24 98.15,38.61 CANL_3_C3.TP 94.18,41.3 v88.9,41.3 82.83,41.3 80.75,39.22 CANL_4_C3.TP 80.7,38.66 v74.12,38.66
CANL_C4  (via drill 0.6)
  Top 0.406: X2.6 17.4,31.45 v17.45,31.5
  Bottom 0.406: v17.45,31.5 17.48,31.5 19.02,33.05 19.02,37.62 20.07,38.66 CANL_2_C4.TP
  Bottom 0.813: CANL_1_C4.TP 22.1,22.66 24.97,19.79 35.08,19.79 CANL_3_C4.TP 40.44,25.15 40.44,36.91 38.68,38.66 CANL_4_C4.TP 35.23,41.38 24.97,41.38 22.25,38.66 CANL_2_C4.TP
CMOD
  Top 0.305: U1.29 226.75,23.98 223.65,20.88 223.65,11.91 225.35,10.21 R18.2
  Top 0.813: R18.2 227.66,8.9 C4.1
CTANK
  Top 0.305: C5.1 230.58,10.08 230.1,10.57 226.75,10.57 224.84,12.47 224.84,21.06 227.2,23.42 227.2,26.68 U1.30
GND3  (via drill 0.6)
  Top 0.305: 86.06,29.56 R7.1
  Top 0.406: 86.06,29.56 R21.2 | X1.3 106.85,48.43 108.13,49.71 108.13,54.36 108.94,55.17 109.27,55.17 | 109.27,55.17 111.4,55.17 GND_C3.TP | v107.09,56.79 107.65,56.79 109.27,55.17 | v91.19,26.82 89.31,26.82 88.72,27.41 88.72,29.53 R7.1 | v91.2,26.83 102.5,26.83 v102.57,26.9
  Bottom 0.406: GND_4_C3.TP 70.84,44.32 69.06,46.1 69.06,54.99 70.87,56.79 v107.09,56.79 | U4.4 v91.2,26.83 v91.19,26.82
  Bottom 0.813: GND_3_C3.TP GND_4_C3.TP 102.51,44.32 102.62,44.22 102.62,26.95 v102.57,26.9 102.57,16.99 GND_2_C3.TP GND_1_C3.TP
  pour Top (isolate 0.762): 61.04,3 112.45,2.9 112.42,13.26 114.33,13.26 114.3,47.88 112.34,47.85 112.24,58.24 61.04,58.24
  pour Bottom (isolate 0.762): 61.04,2.9 112.45,2.92 112.4,13.23 114.3,13.26 114.27,47.8 112.37,47.88 112.24,58.29 61.04,58.24
GND4  (via drill 0.6)
  Top 0.305: R22.2 R9.1 | 27.28,16.99 v27.33,16.94
  Top 0.406: v30,26.87 R9.1 | R22.2 27.28,16.99 | X2.3 8.43,32.95 7.39,33.98 7.39,38.58 8.89,40.08 11.91,40.08 12.67,40.84 12.67,44.17 v12.52,44.32
  Bottom 0.305: U5.4 32.6,27.27 32.18,26.85 30.1,26.82 v30,26.87
  Bottom 0.406: v12.52,44.32 16.18,44.32 GND_4_C4.TP
  Bottom 0.813: GND_4_C4.TP GND_3_C4.TP GND_2_C4.TP v27.33,16.94 GND_1_C4.TP
  pour Top (isolate 0.762): 2.59,3.17 57.53,3.17 57.53,58.09 2.39,58.09 2.39,3.23
  pour Bottom (isolate 0.762): 2.59,3.17 57.53,3.17 57.53,58.09 2.39,58.09 2.39,3.23
GND_C1  (via drill 0.6)
  Top 0.305: 213.27,51.31 R13.1 | 224.26,38.09 U1.57 224.23,37.21 223.9,36.88 219.53,36.88 219.05,37.36 v219.05,38.25 219.05,38.28 | U1.17 220.74,26.73 | 225.37,6.98 R18.1 223.11,7 R17.2 222.84,8.97 C6.2 222.9,10.33 222.3,10.92 216.59,10.92 215.93,11.58 215.93,12.83 U$1.2 215.87,15.39 v215.8,15.47 | C10.2 209.72,51.96 210.29,52.53 212.67,52.53 213.23,51.97 213.23,51.66 | 213.23,51.66 213.23,51.09 R13.1 | 213.23,51.66 213.33,51.56 213.33,50.29 214.17,49.45 216.41,49.45 | C7.2 203.23,51.03 204.62,49.63 212.78,49.63 213.31,50.17 213.31,50.99 R13.1 | 220.74,26.73 220.73,26.72 218.92,26.72 v218.9,26.69 | 191.95,24.13 v191.87,24.21 192.1,24.44 207.52,24.44 207.92,24.84 v207.92,26.75 | 192.15,33.12 v191.87,33.4 191.87,28.37 192.28,27.97 199.49,27.97 201.31,29.78 201.79,29.78 | 216.41,49.45 217.22,50.27 217.22,50.78 219.63,53.19 222.99,53.19 223.49,52.68 223.49,51.31 223.98,50.83 224,50.83 224.54,50.32 224.51,48.88 CN1.D- | 216.41,49.45 216.41,44.37 v216.46,44.32 | U1.10 217.03,31.66 215.04,29.67 215.04,27.43 214.66,27.05 213.49,27.05 v212.95,26.64 | 220.74,26.73 220.78,26.73 220.78,29.82 221.28,30.33 224.61,30.33 225.86,31.57 225.86,35.46 226.62,36.22 227.63,36.22 228.24,36.83 U1.49 | C8.2 C9.2 230.32,14.3 231.9,14.3 232.36,13.84 232.36,7.49 231.83,6.96 230.59,6.96 C5.2
  Top 0.406: 201.79,29.78 R19.2 R12.1
  Top 0.813: GND_C1.TP 199.11,53.24 200.38,51.94 203.19,51.94 C7.2 | C5.2 227.86,6.95 C4.2 225.48,6.87 R18.1
  Bottom 0.305: v219.05,38.25 219.05,44.07 GND_3_C1.TP | U2.4 207.63,27.06 207.95,26.75 v207.92,26.75 | GND_2_C1.TP 218.9,17.3 v218.9,26.69 218.54,26.64 v212.95,26.64
  Bottom 0.61: 191.49,43.94 GND_4_C1.TP
  Bottom 0.813: GND_2_C1.TP 217.22,16.89 v215.8,15.47 195.55,15.47 194.08,16.94 191.92,16.94 GND_1_C1.TP v191.87,24.21 v191.87,33.4 GND_4_C1.TP v216.46,44.32 GND_3_C1.TP
  pour Bottom (isolate 0.762): 181.15,57.94 181.15,48.08 179.04,48.01 179.1,13.36 181.48,13.36 181.48,2.79 232.77,2.79 232.77,57.94 181.25,57.94 181.25,58.04
  pour Top (isolate 0.762): 181.15,57.84 181.15,47.98 178.99,47.93 179.1,13.33 181.48,13.26 181.48,2.74 232.77,2.84 232.77,57.84 181.25,57.84 181.25,57.94
GND_C2  (via drill 0.6)
  Top 0.406: R5.1 R20.2
  Top 0.813: v140.79,44.7 v140.78,44.72 140.78,49.2 IC1.1 140.87,49.91 135.43,55.35 121.54,55.35 GND_C2_C3.TP | 156.03,44.88 v156.21,44.7 153.67,44.7 152.27,46.1 R23.2 v157.84,53.09 | GND_C2.TP 170.56,53.21 169.37,52.02 v168.43,52.02 | R20.2 143.04,29.4 142.39,30.05 142.39,34.85 141.05,36.19 133.86,36.19 133.45,35.79 v133.45,32.97
  Bottom 0.813: 133.45,16.15 GND_2_C2.TP v133.45,32.97 133.45,41.33 136.83,44.7 v140.79,44.7 v156.21,44.7 160.5,44.7 GND_1_C2.TP 160.76,44.2 160.76,30.05 160.35,29.64 160.32,29.64 159.46,28.78 159.56,28.68 159.56,25.7 158.98,25.12 154.08,25.12 153.24,25.96 153.24,28.3 152.75,28.78 U3.4 | 133.45,16.15 133.45,13.26 134.65,12.06 147.17,12.06 | v168.43,52.02 158.85,52.07 v157.84,53.09 | DINA.3 132.56,10.67 133.5,11.61 133.5,16.1 133.45,16.15
  pour Top (isolate 0.813): 120.6,2.84 173.66,2.82 173.66,13.28 171.63,13.26 171.63,47.78 173.66,47.75 173.66,58.22 120.5,58.24 120.5,47.57 122.68,47.57 122.68,12.95 120.6,13
  pour Bottom (isolate 0.813): 120.62,2.82 173.69,2.82 173.69,13.28 171.53,13.26 171.53,47.78 173.69,47.75 173.69,58.22 120.45,58.27 120.45,47.6 122.58,47.57 122.58,12.95 120.62,12.98
LED_S1  (via drill 0.6)
  Top 0.305: U1.2 216.69,35.64 v215.8,36.47
  Bottom 0.305: 203.01,29.59 LED1.A | 201.57,29.92 201.27,30.23 201.27,34.27 202.21,35.2 214.53,35.2 v215.8,36.47
  Bottom 0.406: 203.01,29.59 201.9,29.59 201.57,29.92
LED_S2
  Top 0.305: U1.3 215.21,35.16 214.22,36.14 214.22,40 209.3,44.93 191.9,44.93 186.08,39.12 L_C2.TP
LED_S2_C2  (via drill 0.6)
  Top 0.813: L_C2_C1.TP 162.13,39.01 158.65,35.53 158.65,26.34 157.66,25.35 144.4,25.35 v144.35,25.3
  Bottom 0.813: v144.35,25.3 144.35,29.28 LED2.A
LED_S3
  Top 0.305: U1.4 214.34,34.66 212.83,36.17 212.83,39.37 208.23,43.97 193.27,43.97 191.16,41.86 191.16,41.83 185.57,36.25 180.06,36.25 L_C3.TP
LED_S3_C3  (via drill 0.6)
  Top 0.305: L_C2_C3.TP 106.76,20.95 104.57,18.77 83.03,18.77 80.87,20.93 80.87,25.68 81.94,26.75 85.65,26.75 v85.7,26.8
  Bottom 0.305: v85.7,26.8 86.06,27.15 86.06,29.45 LED3.A
LED_S4
  Top 0.305: U1.5 213.67,34.16 213.66,34.16 212.67,34.16 211.76,35.08 211.76,38.18 206.96,42.98 194.41,42.98 184.58,33.15 184.58,33.12 180.01,33.12 L_C4.TP
LED_S4_C4  (via drill 0.6)
  Top 0.406: X2.5 6.93,31.95 v6.88,31.9
  Bottom 0.406: v6.88,31.9 13.31,31.9 15.09,30.12 15.09,26.21 16.21,25.09 26.64,25.09 27.41,25.86 LED4.A
LED_T_S4  (via drill 0.6)
  Top 0.406: X1.5 104.91,49.43 105.99,50.52 105.99,53.75 v106.04,53.8 | v108.18,17.91 L_C2_C4.TP
  Bottom 0.406: v106.04,53.8 107.59,53.8 108.13,53.26 108.13,17.96 v108.18,17.91
MOTOR  (via drill 0.6)
  Top 0.305: U1.62 U1.63 221.24,39.37 218.39,42.22 216,42.22 212.42,45.8 188.19,45.8 187.12,44.73 v187.12,44.04
  Top 0.813: S1.3 201.17,7.16 200.33,8 200.33,13.72 199.44,14.61 187.83,14.61 187.2,15.24 187.2,16.08 v187.07,16.2
  Bottom 0.305: v187.12,44.04 v187.07,16.2
N$1
  Top 0.305: 223.67,47.09 223.88,46.89 226.64,46.89 227.43,46.1 227.43,44.59 R1.1
  Top 0.406: 223.67,47.09 CN1.D+
N$2
  Top 0.305: CN1.ID 222.87,46.67 223.27,46.28 224.33,46.28 224.97,45.64 224.97,44.64 R2.1
N$3
  Top 0.305: R3.1 222.1,48.82 CN1.GND
N$4
  Top 0.305: R13.2 210.21,51.08 209.6,50.47 206.35,50.47 205.74,51.08 205.74,51.83 R11.2
N$5  (via drill 0.6)
  Top 0.305: U$1.7 215.87,4.4 R16.2 216.24,4.09 v218.21,4.01
  Top 0.813: S1.4 208.31,9.7 v208.33,9.68
  Bottom 0.305: v218.21,4.01 218.26,4.04 209.58,4.04 208.28,5.33 208.28,9.63 v208.33,9.68
N$6  (via drill 0.6)
  Top 0.813: R5.2 v146.99,34.54
  Bottom 0.813: v146.99,34.54 146.99,32.62 U3.2
N$7  (via drill 0.6)
  Top 0.813: CANH_C2.TP 168.5,10.39 v168.38,10.26 | v141.3,16.76 138.23,16.76 v136.37,14.91 | 136.19,15.09 v136.37,14.91 | CANH_C2_C3.TP 123.11,9.91 124.26,11.05 124.26,14.25 124.97,14.96 136.32,14.96 v136.37,14.91
  Bottom 0.813: CANH_2_C2.TP 157.25,42.37 137.82,42.37 135.18,39.73 135.18,22.56 136.37,21.36 CANH_1_C2.TP v136.37,14.91 | v168.38,10.26 153.54,10.29 152.7,11.12 152.7,15.22 151.16,16.76 v141.3,16.76
N$8  (via drill 0.6)
  Top 0.305: v89.38,34.72 89.38,32.14 R7.2
  Bottom 0.305: U4.2 89.4,34.63 v89.38,34.72
N$9
  Top 0.305: U$1.8 R17.1
N$10  (via drill 0.6)
  Top 0.305: R9.2 v30,34.57
  Bottom 0.305: v30,34.57 30,33.21 U5.2
N$11  (via drill 0.6)
  other vias: 225.86,51.92
N$12  (via drill 0.6)
  other vias: 221.49,51.92
N$13
  Top 0.813: DN_C1.TP 194.61,4.83 S1.2
N$14  (via drill 0.6)
  Top 0.406: R19.1 203.05,33.6 v203.07,33.63
  Bottom 0.406: v203.07,33.63 203.07,31.68 LED1.C
N$15  (via drill 0.6)
  Top 0.813: v144.4,34.54 144.4,31.33 R20.1
  Bottom 0.813: LED2.C 144.37,34.42 v144.4,34.54
N$16  (via drill 0.6)
  Top 0.305: R21.1 86.03,34.49 v86,34.67
  Bottom 0.305: v86,34.67 86,31.71 LED3.C
N$17  (via drill 0.6)
  Top 0.305: R22.1 25.26,31.61 v25.25,31.62
  Bottom 0.305: v25.25,31.62 27.32,31.62 LED4.C
N$18
  Top 0.813: R23.1 155.48,54.98 LED5.C
N$19  (via drill 0.6)
  Top 0.813: DN_C2.TP v168.4,4.83
  Bottom 0.813: v168.4,4.83 150.32,4.83 | 150.32,4.83 149.33,4.83 | DINA.1 130.94,5.59 131.72,4.8 150.29,4.8 150.32,4.83
N$20
  Top 0.813: L_C1_C4.TP 136.47,17.78 137.19,18.49 159.56,18.49 161.34,20.27 161.34,30.96 163.91,33.53 L_C4_C1.TP
N$21  (via drill 0.6)
  Top 0.305: R12.2 v205.56,33.6
  Bottom 0.305: v205.56,33.6 205.59,32.4 U2.2
N$22
  Top 0.813: L_C3_C2.TP 128.88,20.95 129.92,19.91 158.47,19.91 160.05,21.49 160.05,33.58 162.76,36.3 170.23,36.3 L_C1_C3.TP
N$23  (via drill 1.3)
  other vias: 213.59,30.61
N$24  (via drill 1.3)
  other vias: 205.59,38.61
N$25  (via drill 1.3)
  other vias: 197.59,30.61
N$26  (via drill 0.6)
  Top 0.813: S3_T_C3_C1.TP 166.27,24.87 v166.19,24.79 | v143.66,22.4 129.18,22.4 v128.65,22.94 | v128.6,32.54 122.76,32.54 S3_T_C1_C3.TP
  Bottom 0.813: v166.19,24.79 165.71,24.79 164.19,23.27 164.19,20.83 163.47,20.12 144.4,20.12 143.66,20.85 v143.66,22.4 | v128.65,22.94 128.65,32.49 v128.6,32.54
N$27  (via drill 0.6)
  Top 0.813: v166.32,22.05 S4_T_C4_C1.TP | v142.04,25.04 128.17,25.04 126.29,26.92 S4_T_C1_C4.TP
  Bottom 0.813: v142.04,25.04 142.04,19.91 143.23,18.72 165.2,18.72 166.32,19.84 v166.32,22.05
N$28  (via drill 1.3)
  other vias: 205.56,22.61
N$29  (via drill 0.6)
  Top 0.813: VCC_C1.TP 192.05,49.99 v194.79,47.24
  Bottom 0.61: VCC_2_C1.TP 188.82,14.1
  Bottom 0.813: VCC_1_C1.TP VCC_2_C1.TP VCC_4_C1.TP v194.79,47.24 VCC_3_C1.TP
N$30  (via drill 1.3)
  other vias: 139.14,30.61
N$31  (via drill 1.3)
  other vias: 147.14,38.63
N$32  (via drill 0.6)
  Top 0.813: CANL_C2.TP v168.43,7.62 | CANL_C2_C3.TP 124.46,5.99 125.65,7.19 125.65,12.06 126.64,13.06 138.23,13.06 139.22,14.05 139.22,14.94 v139.24,14.96
  Bottom 0.813: CANL_2_C2.TP 152.25,38.61 150.14,40.72 140.82,40.72 136.98,36.88 136.98,24.79 CANL_1_C2.TP 139.22,22.56 v139.24,14.96 139.37,15.09 149.56,15.09 150.55,14.1 150.55,8.81 151.74,7.62 v168.43,7.62
N$33  (via drill 1.3)
  other vias: 155.14,30.61
N$34  (via drill 1.3)
  other vias: 147.14,22.61
N$35  (via drill 1.3)
  other vias: 80.75,30.61
N$36  (via drill 1.3)
  other vias: 88.75,38.63
N$37  (via drill 1.3)
  other vias: 96.75,30.61
N$38  (via drill 1.3)
  other vias: 88.75,22.61
N$39  (via drill 1.3)
  other vias: 21.97,30.68
N$40  (via drill 1.3)
  other vias: 29.97,38.68
N$41  (via drill 1.3)
  other vias: 37.97,30.68
N$42  (via drill 1.3)
  other vias: 29.97,22.66
P0_1  (via drill 0.6)
  Top 0.305: R11.1 205.79,55.8 206.6,56.59 206.6,56.62 207.19,57.2 228.47,57.2 230.05,55.63 230.05,52.38 v230.02,52.35 | U1.40 228.93,32.16 228.57,32.51 228.57,36.53 v229.9,37.85
  Bottom 0.305: v229.9,37.85 230.25,37.85 230.66,38.28 232.13,38.28 232.36,38.48 232.36,51.28 231.29,52.35 v230.02,52.35
P0_4
  Top 0.305: U1.43 231.21,33.66 231.57,33.3 231.57,25.17 231.6,25.15 231.6,23.77 231.57,23.75 231.57,21.69 230.84,20.95 228.65,20.95 227.83,20.13 CRYSTAL.2
  Top 0.813: C8.1 226.75,18.33 CRYSTAL.2
P0_5
  Top 0.305: U1.44 231.85,34.16 232.21,33.81 232.21,20.53 230.3,18.63
  Top 0.813: C9.1 230.3,18.63 CRYSTAL.1
S1_T  (via drill 0.6)
  Top 0.305: U1.6 209.98,33.66 R4.1 v207.87,33.58
  Bottom 0.305: v207.87,33.58 207.87,32.4 U2.3
S2_T
  Top 0.305: U1.7 211.39,33.16 210.36,32.13 210.36,23.67 206.63,19.94 192.18,19.94 191.21,20.9 189.31,20.9 187.38,22.83 187.38,26.01 185.65,27.74 S2_T_C2.TP
S2_T_C2  (via drill 0.6)
  Top 0.813: S2_T_C2_C1.TP v166.19,27.84 | v151.99,27.15 v151.99,32.46 | R6.1 v149.63,34.49
  Bottom 0.813: v151.99,32.46 149.11,32.46 U3.3 149.61,32.95 v149.63,34.49 | v151.99,27.15 151.99,24.28 152.7,23.57 161.92,23.57 v166.19,27.84
S3_T
  Top 0.305: U1.8 212.06,32.66 211.18,31.78 211.18,23.42 207.04,19.28 191.69,19.28 190.88,20.09 188.72,20.09 186.39,22.43 186.39,23.9 185.37,24.92 S3_T_C3.TP
S3_T_C3  (via drill 0.6)
  Top 0.305: S3_T_C3_C2.TP 103.28,32.77 101.37,34.67 91.39,34.67 | R8.1 91.39,34.21 | 91.39,34.21 91.39,34.67 | 91.39,34.67 v91.27,34.78 | v91.27,34.78 91.24,34.82 | v91.27,34.78 91.27,34.33 91.39,34.21
  Bottom 0.305: U4.3 91.2,34.71 v91.27,34.78
S4_J_C4  (via drill 0.6)
  Top 0.406: X2.4 16.45,32.45 17.81,33.81 17.81,42.06 19.63,43.89 33.17,43.89 34.52,42.55 34.52,36.35 v32.66,34.49 32.66,31.63 R10.1 32.73,31.57
  Bottom 0.406: U5.3 32.6,34.43 v32.66,34.49
S4_T  (via drill 0.6)
  Top 0.305: S4_T_C4.TP 185.32,21.97 187.91,19.38 190.4,19.38 191.16,18.62 207.49,18.62 212.01,23.14 212.01,27.81 212.32,28.12 v212.93,28.12 | v215.49,31.67 215.49,31.8 216,32.13 218.76,32.13 U1.9
  Bottom 0.305: v212.93,28.12 215.16,28.12 215.52,28.5 v215.49,31.67
S4_T_C4  (via drill 0.6)
  Top 0.406: X1.4 92.8,48.93 v92.38,48.51 | v75.69,50.37 75.69,16.87 78.49,14.07 110.13,14.07 v110.19,14.02 | v110.13,26.8 S4_T_C4_C2.TP
  Bottom 0.406: v92.38,48.51 77.55,48.51 v75.69,50.37 | v110.19,14.02 110.19,26.75 v110.13,26.8
SAR_BY  (via drill 0.6)
  Top 0.305: v218.77,9.04 220.97,9.04 C6.1 | U1.1 217.41,36.16 217.22,36.35 217.22,38.41 v217.25,38.43 | v218.72,12.24 218.72,20.83 219.58,21.69 219.79,21.67 v220.19,22.05
  Bottom 0.305: v218.72,12.24 218.72,9.09 v218.77,9.04 | v217.25,38.43 217.22,38.41 217.22,36.42 217.45,36.19 218.64,36.19 219.23,35.61 219.23,28.47 220.17,27.53 220.17,22.89 v220.19,22.05
SWDCLK  (via drill 0.6)
  Top 0.305: R2.2 v224.87,40.64 | v223.7,24.49 222.78,25.53 U1.21
  Bottom 0.305: v223.7,24.49 222.78,25.48 222.78,35.74 224.82,37.77 224.82,40.59 v224.87,40.64
SWDIO  (via drill 0.6)
  Top 0.305: R3.2 222.1,40.87 v221.92,40.69 | v221.92,24.51 221.92,24.74 222.25,25.07 222.25,26.7 U1.20
  Bottom 0.305: v221.92,40.69 v221.92,24.51
VCC_C2  (via drill 0.6)
  Top 0.813: VCC_C2_C3.TP 134.34,52.45 135.69,51.11 135.69,47.07 v135.61,46.99 | 148.08,47.3 v148.39,46.99 148.13,47.24 148.13,49.05 147.27,49.91 IC1.3 | VCC_C2.TP 169.34,49.89 v168.4,49.86
  Bottom 0.813: v168.4,49.86 166.55,49.86 VCC_2_C2.TP 164.11,47.42 164.31,47.42 163.88,46.99 v148.39,46.99 v135.61,46.99 130.66,42.04 VCC_1_C2.TP 130.61,14.02 128.65,14.02 127.91,13.28 127.91,8.66 128.45,8.13 DINA.2
VCC_C3  (via drill 0.6)
  Top 0.406: X1.2 96.98,47.93 v96.04,46.99 | VCC_C3.TP 110.85,52.58 109.75,51.46 109.75,48.67 v109.7,48.62
  Bottom 0.406: v109.7,48.62 109.7,54.56 108.56,55.7 97.15,55.7 96.04,54.56 v96.04,46.99
  Bottom 0.813: VCC_1_C3.TP VCC_2_C3.TP VCC_3_C3.TP v96.04,46.99 72.36,46.99 VCC_4_C3.TP
VCC_C4  (via drill 0.6)
  Top 0.406: X2.2 15.69,33.45 16.23,33.98 16.23,36.55 v16.28,36.6 | v9.88,41.94 v9.88,47.17
  Bottom 0.406: v16.28,36.6 10.67,36.6 9.83,37.44 9.83,41.89 v9.88,41.94 | v9.88,47.17 VCC_4_C4.TP
  Bottom 0.813: VCC_1_C4.TP VCC_2_C4.TP VCC_3_C4.TP VCC_4_C4.TP
VCCD  (via drill 0.6)
  Top 0.305: v231.24,44.45 231.24,45.87 231.95,46.58 231.88,46.66 231.88,55.78 229.87,57.78 204.32,57.78 203.94,57.4 203.94,57.38 203.17,56.62 203.17,54.95 C7.1 | U1.48 230.67,36.16 231.27,36.75 231.27,39.85 v231.22,39.65
  Bottom 0.305: v231.22,39.65 231.22,44.42 v231.24,44.45
VDDA
  Top 0.305: 218.71,31.09 U1.11 | U1.56 224.74,31.98 223.92,31.16 U1.11 | VDDA_C1.TP 182.58,19.1 183.01,18.67 189.99,18.67 190.63,18.03 208.05,18.03 213.03,23.01 213.06,23.01 213.56,23.52 213.54,25.58 214.48,26.52 215.24,26.54 215.67,26.97 215.67,29.49 217.3,31.11 218.74,31.11 U1.11
VDDA2
  Top 0.813: 170.26,19.08 171.09,19.08 171.04,19.13 VDDA_C2.TP 170.26,19.08 | L1.2 164.85,15.65 165.96,16.76 165.96,18.11 166.88,19.03 170.21,19.03 170.26,19.08
VDDD  (via drill 0.6)
  Top 0.305: U1.50 227.74,38.99 228.5,39.75 229.21,39.75 v229.29,39.67
  Top 0.813: VDDD_C1.TP 198.2,56.49 v198.65,56.57
  Bottom 0.305: v229.29,39.67 229.29,50.67 228.65,51.31 228.65,54.41 226.49,56.57 199.19,56.57
  Bottom 0.813: v198.65,56.57 199.19,56.57
VDDD2
  Top 0.813: L4.2 165.72,54.85 167.31,56.44 173.08,56.44 VDDD_C2.TP
VDDIO  (via drill 0.6)
  Top 0.305: v220.09,12.27 220.09,18.75 225.22,23.88 225.22,26.7 U1.26 | v197.56,12.78 185.27,12.78 183.95,14.1 183.95,15.72 183.44,16.23 VDDIO_C1.TP
  Bottom 0.305: v197.56,12.78 207.82,12.78 209.42,11.15 209.37,8.61 211.3,6.71 219.46,6.71 220.07,7.37 220.09,11.94 v220.09,12.27
VDDIO2
  Top 0.813: R15.2 166.88,12.34 168.38,13.84 168.38,14.99 169.6,16.2 171.5,16.2 VDDIO_C2.TP
XRES  (via drill 0.6)
  Top 0.305: U1.47 231.44,35.66 232.31,36.53 232.31,41.81 231.32,42.8 227.54,42.8 R1.2 227.41,40.67 v227.43,40.64 | C10.1 211.15,53.86 R14.2 211.3,54.09 v211.3,55.73
  Bottom 0.305: v227.43,40.64 227.43,49.89 227.51,49.96 227.51,54.03 225.81,55.73 v211.3,55.73